# EAGLE schematic 3.7LiPoly Management (EAGLE 9.2.2)
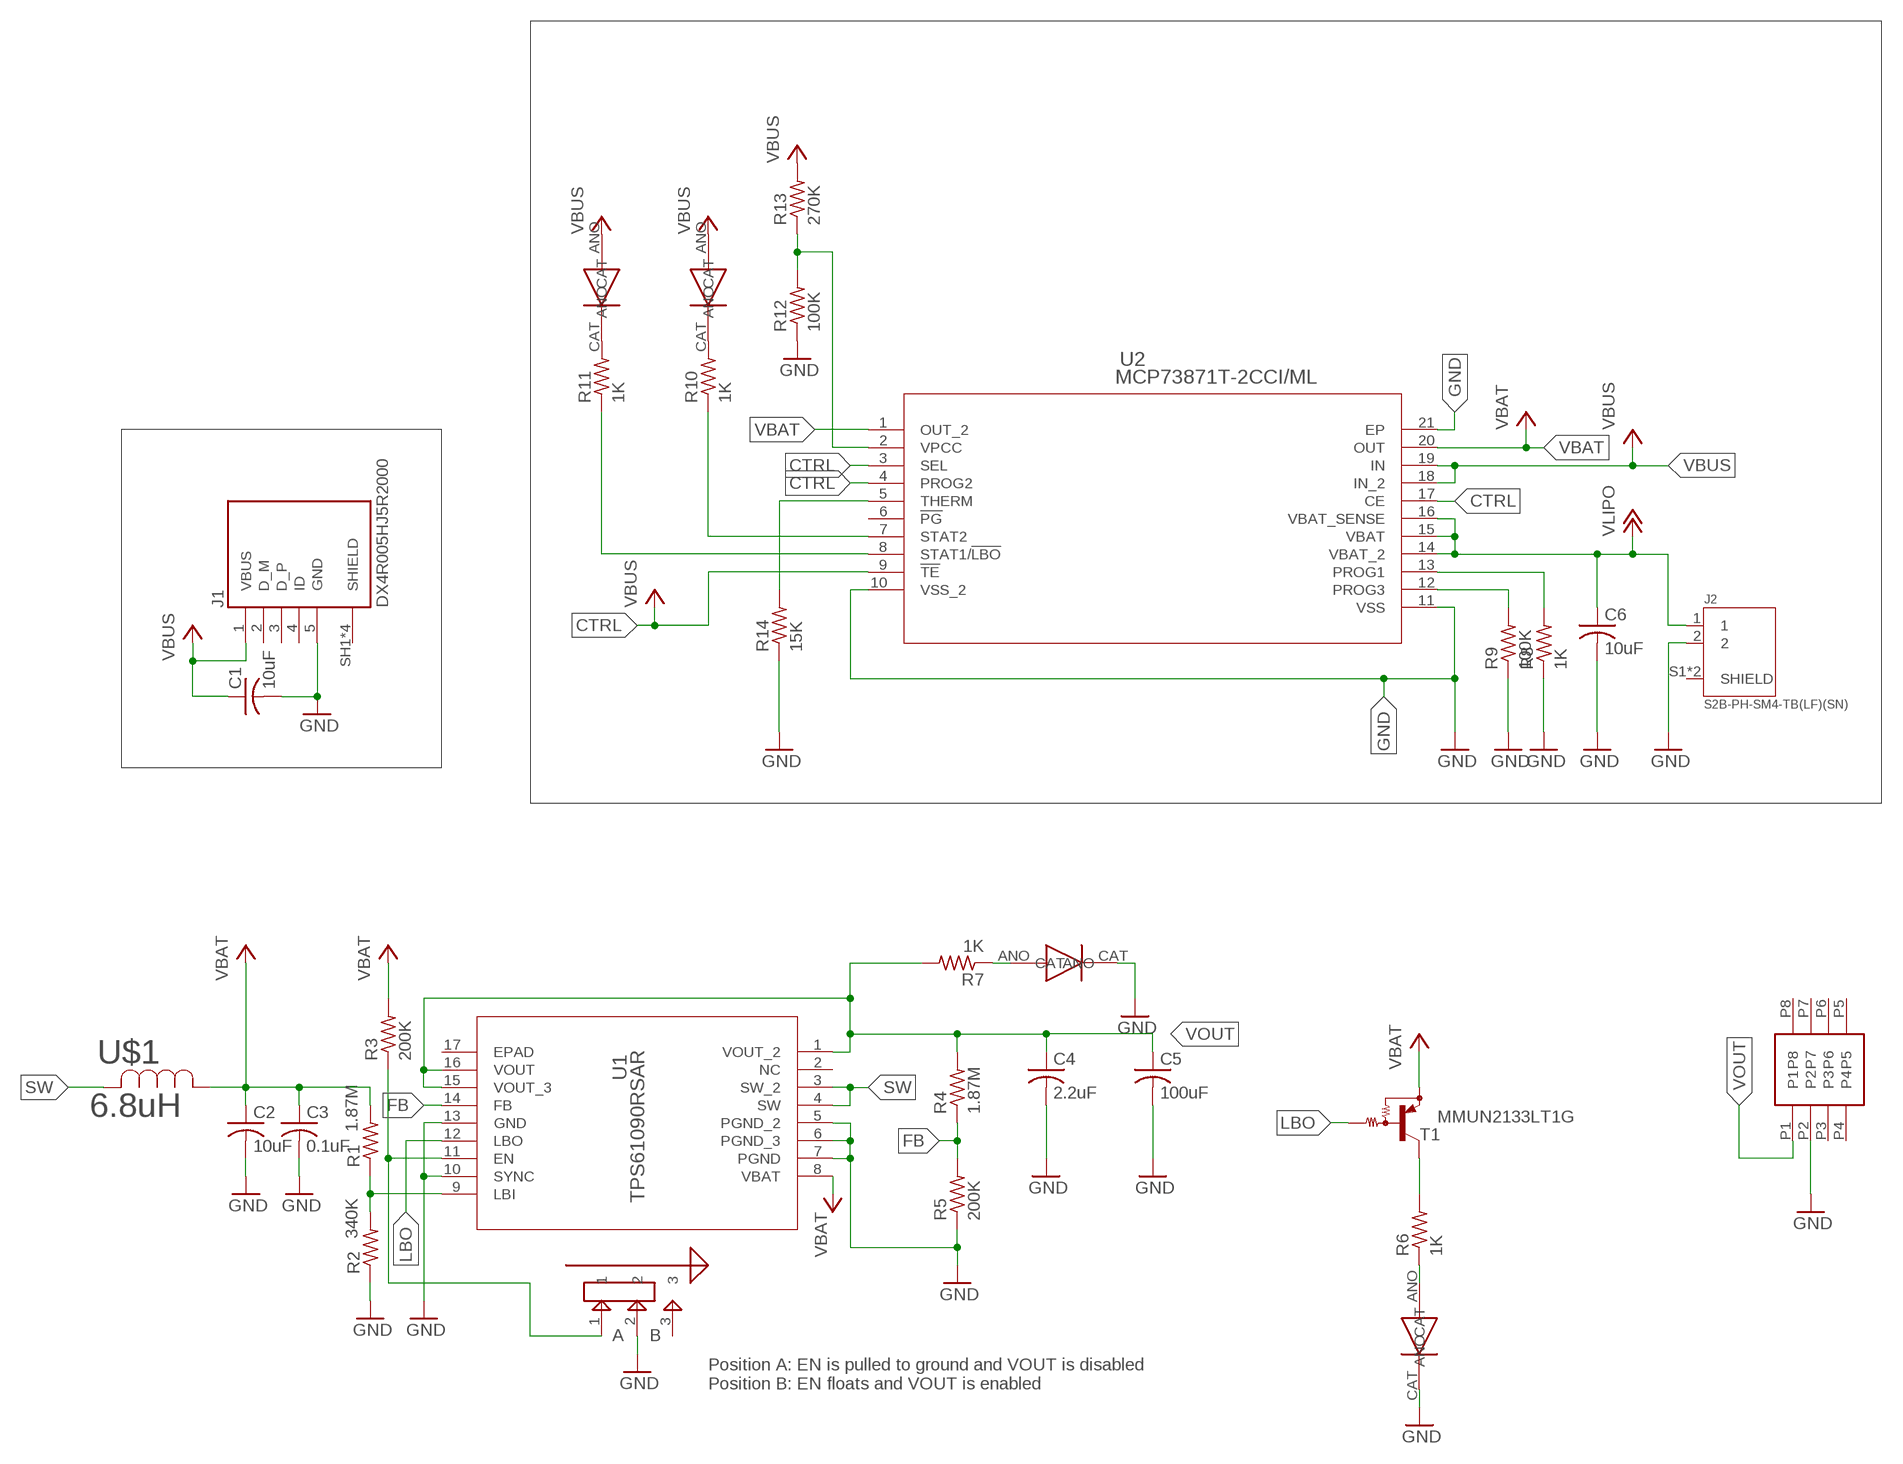
[diagram p0: schematic, sheet 1]

## Parts
C1  10uF  C-USC0805  [C0805]
C2  10uF  C-USC0805  [C0805]
C3  0.1uF  C-USC0805  [C0805]
C4  2.2uF  C-USC0805  [C0805]
C5  100uF  C-USC0805  [C0805]
C6  10uF  C-USC0805  [C0805]
CHARGE  YELLOW  WP934AD  [WP934AD]
DONE  GREEN  WP934AD  [WP934AD]
J1  DX4R005HJ5R2000  [JAE_DX4R005HJ5R2000]
J2  S2B-PH-SM4-TB(LF)(SN)  [JST_S2B-PH-SM4-TB(LF)(SN)]
LBO  RED  WP934AD  [WP934AD]
POWERON  BLUE  WP934EW  [WP934EW]
R1  1.87M  R-US_R0805  [R0805]
R2  340K  R-US_R0805  [R0805]
R3  200K  R-US_R0805  [R0805]
R4  1.87M  R-US_R0805  [R0805]
R5  200K  R-US_R0805  [R0805]
R6  1K  R-US_R0805  [R0805]
R7  1K  R-US_R0805  [R0805]
R8  1K  R-US_R0805  [R0805]
R9  100K  R-US_R0805  [R0805]
R10  1K  R-US_R0805  [R0805]
R11  1K  R-US_R0805  [R0805]
R12  100K  R-US_R0805  [R0805]
R13  270K  R-US_R0805  [R0805]
R14  15K  R-US_R0805  [R0805]
T1  MMUN2133LT1G  MUN2114T1-PNP_DRIVER-SC59-BEC  [SC59-BEC]
U1  TPS61090RSAR  [RSA16_2P7X2P7]
U2  MCP73871T-2CCI/ML  [QFN20_4X4MC]
U$1  6.8uH  VLCF5020T  [IND_5028]
U$2  JS102011SAQN  [JS102011SAQN]
U$3  M22-6340442  [M22-6340442]

## Nets
+3V3: CHARGE.ANO DONE.ANO R13.2 ; supply symbol labelled VBUS
CTRL: U2.3(SEL) U2.4(PROG2) U2.9(!TE) U2.17(CE) ; supply symbol labelled VBUS
FB: R4.1 R5.2 U1.14(FB)
GND: C1.2 C2.2 C3.2 C4.2 C5.2 C6.2 J1.5(GND) J2.2 LBO.CAT POWERON.CAT R2.1 R5.1 R8.1 R9.1 R12.1 R14.1 U1.5(PGND_2) U1.6(PGND_3) U1.7(PGND) U1.10(SYNC) U1.13(GND) U2.10(VSS_2) U2.11(VSS) U2.21(EP) U$2.2 U$3.P2
LBO: T1.B U1.12(LBO)
N$1: R1.1 R2.2 U1.9(LBI)
N$2: R3.1 U1.11(EN) U$2.1
N$3: CHARGE.CAT R11.2
N$4: R8.2 U2.13(PROG1)
N$5: R6.2 T1.C
N$6: LBO.ANO R6.1
N$7: POWERON.ANO R7.1
N$8: R9.2 U2.12(PROG3)
N$9: DONE.CAT R10.2
N$11: R11.1 U2.8(STAT1/!LBO)
N$12: R10.1 U2.7(STAT2)
N$13: R14.2 U2.5(THERM)
N$14: R12.2 R13.1 U2.2(VPCC)
SW: U1.3(SW_2) U1.4(SW) U$1.2
VBAT [VBAT]: C2.1 C3.1 R1.2 R3.2 T1.E U1.8(VBAT) U2.1(OUT_2) U2.20(OUT) U$1.1
VBUS: C1.1 J1.1(VBUS) U2.18(IN_2) U2.19(IN)
VLIPO: C6.1 J2.1 U2.14(VBAT_2) U2.15(VBAT) U2.16(VBAT_SENSE)
VOUT: C4.1 C5.1 R4.2 R7.2 U1.1(VOUT_2) U1.15(VOUT_3) U1.16(VOUT) U$3.P1
Unconnected: J1.2(D_M) J1.3(D_P) J1.4(ID) J1.SH1(SHIELD) J1.SH2(SHIELD) J1.SH3(SHIELD) J1.SH4(SHIELD) J2.S1(SHIELD) J2.S2(SHIELD) U1.2(NC) U1.17(EPAD) U2.6(!PG) U$2.3 U$3.P3 U$3.P4 U$3.P5 U$3.P6 U$3.P7 U$3.P8

## Notes on the sheet
- A | B
- Position A: EN is pulled to ground and VOUT is disabled
  Position B: EN floats and VOUT is enabled

## Library data of the parts
C1-C6 = rcl:C-US: CAPACITOR, American symbol; SPICEPREFIX: C
CHARGE DONE LBO = KingBright:WP934AD: LED Circuit Board Indicators 3mm RA. CBI LED INDICATOR
J1 = DX4R005HJ5R2000:DX4R005HJ5R2000: RCPT MICRO USB 2.0 B SMT H/D; DESCRIPTION: DX4 series, receptacle, on-board, right-angle standard mount, surface mount; MF: JAE Electronics; MP: DX4R005HJ5R2000; PACKAGE: None
J2 = S2B-PH-SM4-TB_LF__SN_:S2B-PH-SM4-TB(LF)(SN): PH Series 2 Position 2 mm Pitch Surface Mount Side Entry Shrouded Header; DESCRIPTION: PH Series 2 Position 2 mm Pitch Surface Mount Side Entry Shrouded Header; MF: JST Sales; MP: S2B-PH-SM4-TB_LF__SN_; PACKAGE: FakePackage u
POWERON = KingBright:WP934EW: LED Circuit Board Indicators 3mm RA HOUSING LED
R1-R14 = rcl:R-US_: RESISTOR, American symbol; SPICEPREFIX: R
T1 = transistor:*-PNP_DRIVER-: PNP Bias Resistor Transistor
U1 = TPS61090RSAR:TPS61090RSAR; MANUFACTURER_PART_NUMBER: TPS61090RSAR; VENDOR: Texas Instruments
U2 = MCP73871T-2CCI:MCP73871T-2CCI/ML: Stand-Alone System Load Sharing and Li-Ion/Li-Polymer Battery Charge Management Controller; MANUFACTURER_PART_NUMBER: MCP73871T2CCIML; VENDOR: Microchip
U$1 = VLCF5020T-6R8N1R1:VLCF5020T
U$2 = JS102011SAQN:JS102011SAQN: SPDT SMD Right Angle Switch
U$3 = M22-6340442:M22-6340442: 8 Pin Header 2.0mm pitch